# Altium schematic sheet Wiring Harness Spec.SchDoc: Title Block Template
size A3; Engineer: M. BRINDLEY; Organization: BLUEsat Project; Address1: Room 419; Address2: School of EE&T; Address3: UNSW, NSW 2052; Address4: Australia; DocumentNumber: TITL0001; Version: 1.0
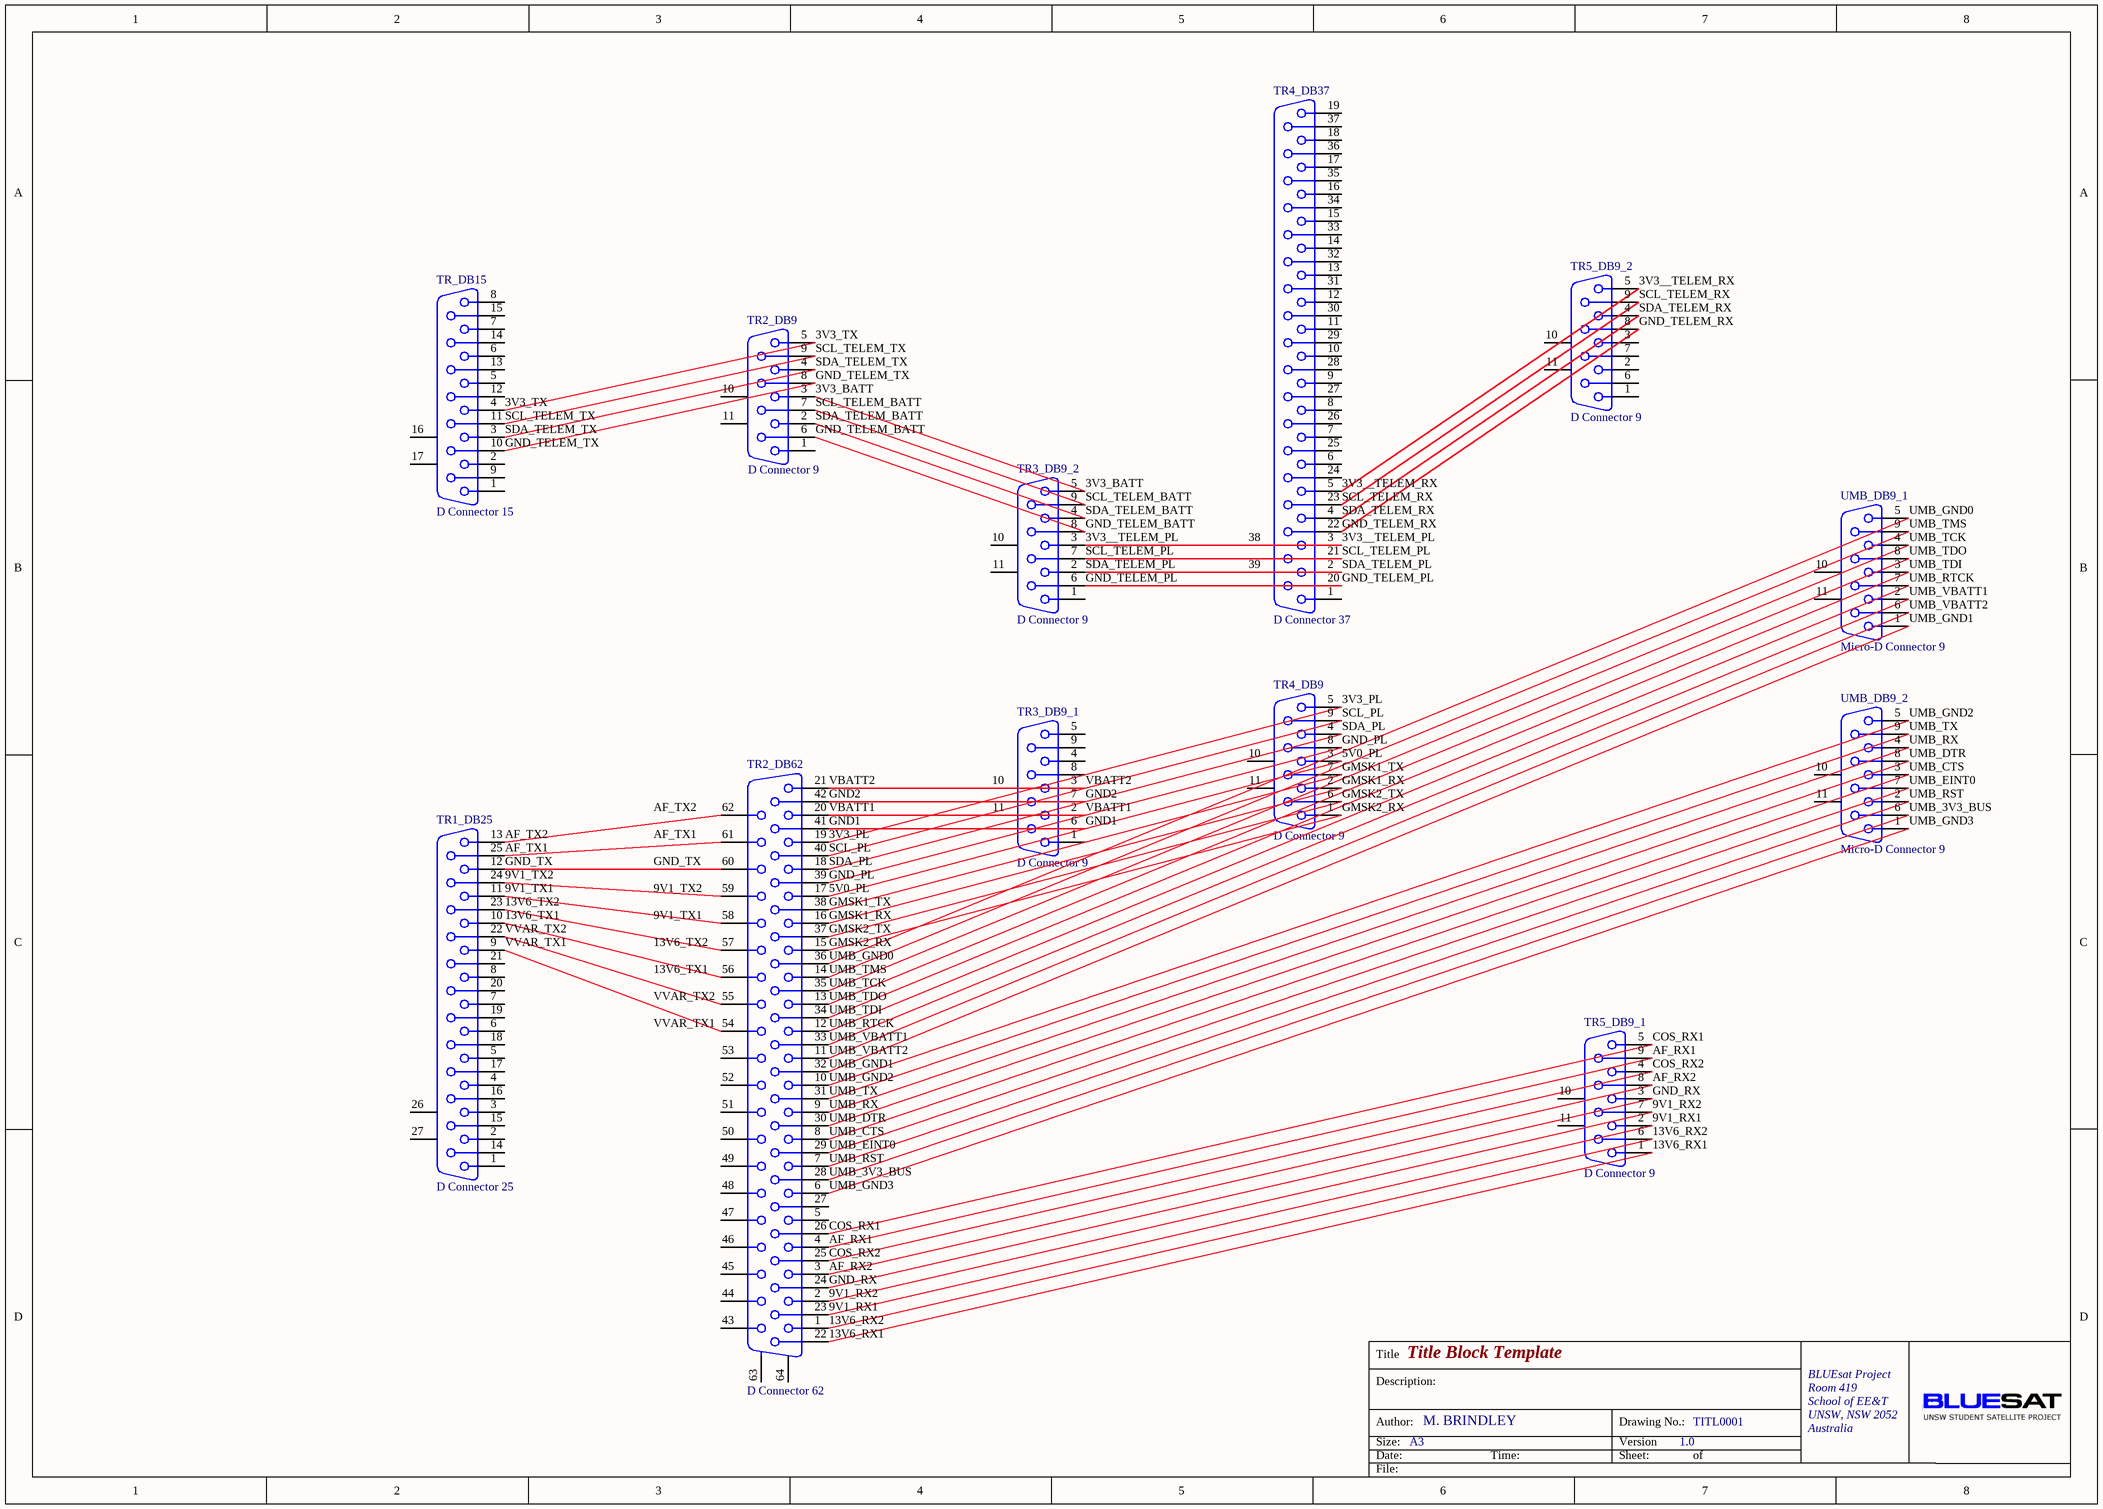
[diagram p0: Wiring Harness Spec.SchDoc]

## Parts
TR1_DB25  D Connector 25  [DSUB1.385-2H25A]
TR2_DB9  D Connector 9  [DSUB1.385-2H9]
TR2_DB62  D Connector 62  [HD-22 62 POS]
TR3_DB9_1  D Connector 9  [DSUB1.385-2H9]
TR3_DB9_2  D Connector 9  [DSUB1.385-2H9]
TR4_DB9  D Connector 9  [DSUB1.385-2H9]
TR4_DB37  D Connector 37
TR5_DB9_1  D Connector 9  [DSUB1.385-2H9]
TR5_DB9_2  D Connector 9  [DSUB1.385-2H9]
TR_DB15  D Connector 15  [DSUB1.385-2H15]
UMB_DB9_1  Micro-D Connector 9  [DSUB1.385-2H9]
UMB_DB9_2  Micro-D Connector 9  [DSUB1.385-2H9]

## Nets
3V3__TELEM_PL: TR3_DB9_2.3 TR4_DB37.3
3V3__TELEM_RX: TR4_DB37.5 TR5_DB9_2.5
3V3_BATT: TR2_DB9.3 TR3_DB9_2.5
3V3_PL: TR2_DB62.19 TR4_DB9.5
3V3_TX: TR2_DB9.5 TR_DB15.4
5V0_PL: TR2_DB62.17 TR4_DB9.3
9V1_RX1: TR2_DB62.23 TR5_DB9_1.2
9V1_RX2: TR2_DB62.2 TR5_DB9_1.7
9V1_TX1: TR1_DB25.11
9V1_TX2: TR1_DB25.24
13V6_RX1: TR2_DB62.22 TR5_DB9_1.1
13V6_RX2: TR2_DB62.1 TR5_DB9_1.6
13V6_TX1: TR1_DB25.10
13V6_TX2: TR1_DB25.23
AF_RX1: TR2_DB62.4 TR5_DB9_1.9
AF_RX2: TR2_DB62.3 TR5_DB9_1.8
AF_TX1: TR1_DB25.25
AF_TX2: TR1_DB25.13
COS_RX1: TR2_DB62.26 TR5_DB9_1.5
COS_RX2: TR2_DB62.25 TR5_DB9_1.4
GMSK1_RX: TR2_DB62.16 TR4_DB9.2
GMSK1_TX: TR2_DB62.38 TR4_DB9.7
GMSK2_RX: TR2_DB62.15 TR4_DB9.1
GMSK2_TX: TR2_DB62.37 TR4_DB9.6
GND1: TR2_DB62.41 TR3_DB9_1.6
GND2: TR2_DB62.42 TR3_DB9_1.7
GND_PL: TR2_DB62.39 TR4_DB9.8
GND_RX: TR2_DB62.24 TR5_DB9_1.3
GND_TELEM_BATT: TR2_DB9.6 TR3_DB9_2.8
GND_TELEM_PL: TR3_DB9_2.6 TR4_DB37.20
GND_TELEM_RX: TR4_DB37.22 TR5_DB9_2.8
GND_TELEM_TX: TR2_DB9.8 TR_DB15.10
GND_TX: TR1_DB25.12
SCL_PL: TR2_DB62.40 TR4_DB9.9
SCL_TELEM_BATT: TR2_DB9.7 TR3_DB9_2.9
SCL_TELEM_PL: TR3_DB9_2.7 TR4_DB37.21
SCL_TELEM_RX: TR4_DB37.23 TR5_DB9_2.9
SCL_TELEM_TX: TR2_DB9.9 TR_DB15.11
SDA_PL: TR2_DB62.18 TR4_DB9.4
SDA_TELEM_BATT: TR2_DB9.2 TR3_DB9_2.4
SDA_TELEM_PL: TR3_DB9_2.2 TR4_DB37.2
SDA_TELEM_RX: TR4_DB37.4 TR5_DB9_2.4
SDA_TELEM_TX: TR2_DB9.4 TR_DB15.3
UMB_3V3_BUS: TR2_DB62.28 UMB_DB9_2.6
UMB_CTS: TR2_DB62.8 UMB_DB9_2.3
UMB_DTR: TR2_DB62.30 UMB_DB9_2.8
UMB_EINT0: TR2_DB62.29 UMB_DB9_2.7
UMB_GND0: TR2_DB62.36 UMB_DB9_1.5
UMB_GND1: TR2_DB62.32 UMB_DB9_1.1
UMB_GND2: TR2_DB62.10 UMB_DB9_2.5
UMB_GND3: TR2_DB62.6 UMB_DB9_2.1
UMB_RST: TR2_DB62.7 UMB_DB9_2.2
UMB_RTCK: TR2_DB62.12 UMB_DB9_1.7
UMB_RX: TR2_DB62.9 UMB_DB9_2.4
UMB_TCK: TR2_DB62.35 UMB_DB9_1.4
UMB_TDI: TR2_DB62.34 UMB_DB9_1.3
UMB_TDO: TR2_DB62.13 UMB_DB9_1.8
UMB_TMS: TR2_DB62.14 UMB_DB9_1.9
UMB_TX: TR2_DB62.31 UMB_DB9_2.9
UMB_VBATT1: TR2_DB62.33 UMB_DB9_1.2
UMB_VBATT2: TR2_DB62.11 UMB_DB9_1.6
VBATT1: TR2_DB62.20 TR3_DB9_1.2
VBATT2: TR2_DB62.21 TR3_DB9_1.3
VVAR_TX1: TR1_DB25.9
VVAR_TX2: TR1_DB25.22

Not connected (* = marked no-connect by the designer): TR1_DB25 1 2 3 4 5 6 7 8 14 15 16 17 18 19 20 21 26(MH1) 27(MH2); TR2_DB9 1 10(MH1) 11(MH2); TR2_DB62 5 27 43 44 45 46 47 48 49 50 51 52 53 54 55 56 57 58 59 60 61 62 63(MH1) 64(MH2); TR3_DB9_1 1 4 5 8 9 10(MH1) 11(MH2); TR3_DB9_2 1 10(MH1) 11(MH2); TR4_DB9 10(MH1) 11(MH2); TR4_DB37 1 6 7 8 9 10 11 12 13 14 15 16 17 18 19 24 25 26 27 28 29 30 31 32 33 34 35 36 37 38(MH1) 39(MH2); TR5_DB9_1 10(MH1) 11(MH2); TR5_DB9_2 1 2 3 6 7 10(MH1) 11(MH2); TR_DB15 1 2 5 6 7 8 9 12 13 14 15 16(MH1) 17(MH2); UMB_DB9_1 10(MH1) 11(MH2); UMB_DB9_2 10(MH1) 11(MH2)

## Notes on the sheet
- Labels drawn without touching a wire or pin: 9V1_TX1, 9V1_TX2, 13V6_TX1, 13V6_TX2, AF_TX1, AF_TX2, GND_TX, VVAR_TX1, VVAR_TX2
- Title
- Description:
- Size:
- Author:
- Date:
- A3
- Time:
- Version
- Sheet:
- Drawing No.:
- of
- File:

## Library data of the parts
TR1_DB25 = D Connector 25: Receptacle Assembly, 25 Position, Right Angle; PackageDocument: U; Positions: 25; Published: 15-Jun-2001; LatestRevisionDate: 17-Jul-2002; LatestRevisionNote: Re-released for DXP Platform.; DatasheetDocument: 19-Mar-1999; PackageReference: 787202; Publisher: Altium Limited; Orientation: Right Angle; Gender: Receptacle
TR2_DB9 TR3_DB9_1 TR3_DB9_2 TR4_DB9 TR5_DB9_1 TR5_DB9_2 UMB_DB9_1 UMB_DB9_2 = D Connector 9: Receptacle Assembly, 9 Position, Right Angle; PackageDocument: O; Positions: 9; Published: 15-Jun-2001; LatestRevisionDate: 17-Jul-2002; LatestRevisionNote: Re-released for DXP Platform.; DatasheetDocument: 1-Sep-1999; PackageReference: 788750; Publisher: Altium Limited; Orientation: Right Angle; Gender: Receptacle
TR2_DB62 = Connector 62
TR4_DB37 = D Connector 37: Receptacle Assembly, 37 Position, Right Angle; PackageDocument: U; Positions: 25; Published: 15-Jun-2001; LatestRevisionDate: 17-Jul-2002; LatestRevisionNote: Re-released for DXP Platform.; DatasheetDocument: 19-Mar-1999; PackageReference: 787202; Publisher: Altium Limited; Orientation: Right Angle; Gender: Receptacle
TR_DB15 = D Connector 15: Receptacle Assembly, 15 Position, Right Angle; PackageDocument: O; Positions: 15; Published: 15-Jun-2001; LatestRevisionDate: 17-Jul-2002; LatestRevisionNote: Re-released for DXP Platform.; DatasheetDocument: 1-Sep-99; PackageReference: 788757; Publisher: Altium Limited; Orientation: Right Angle; Gender: Receptacle